# EAGLE schematic Svari (EAGLE 9.5.2)
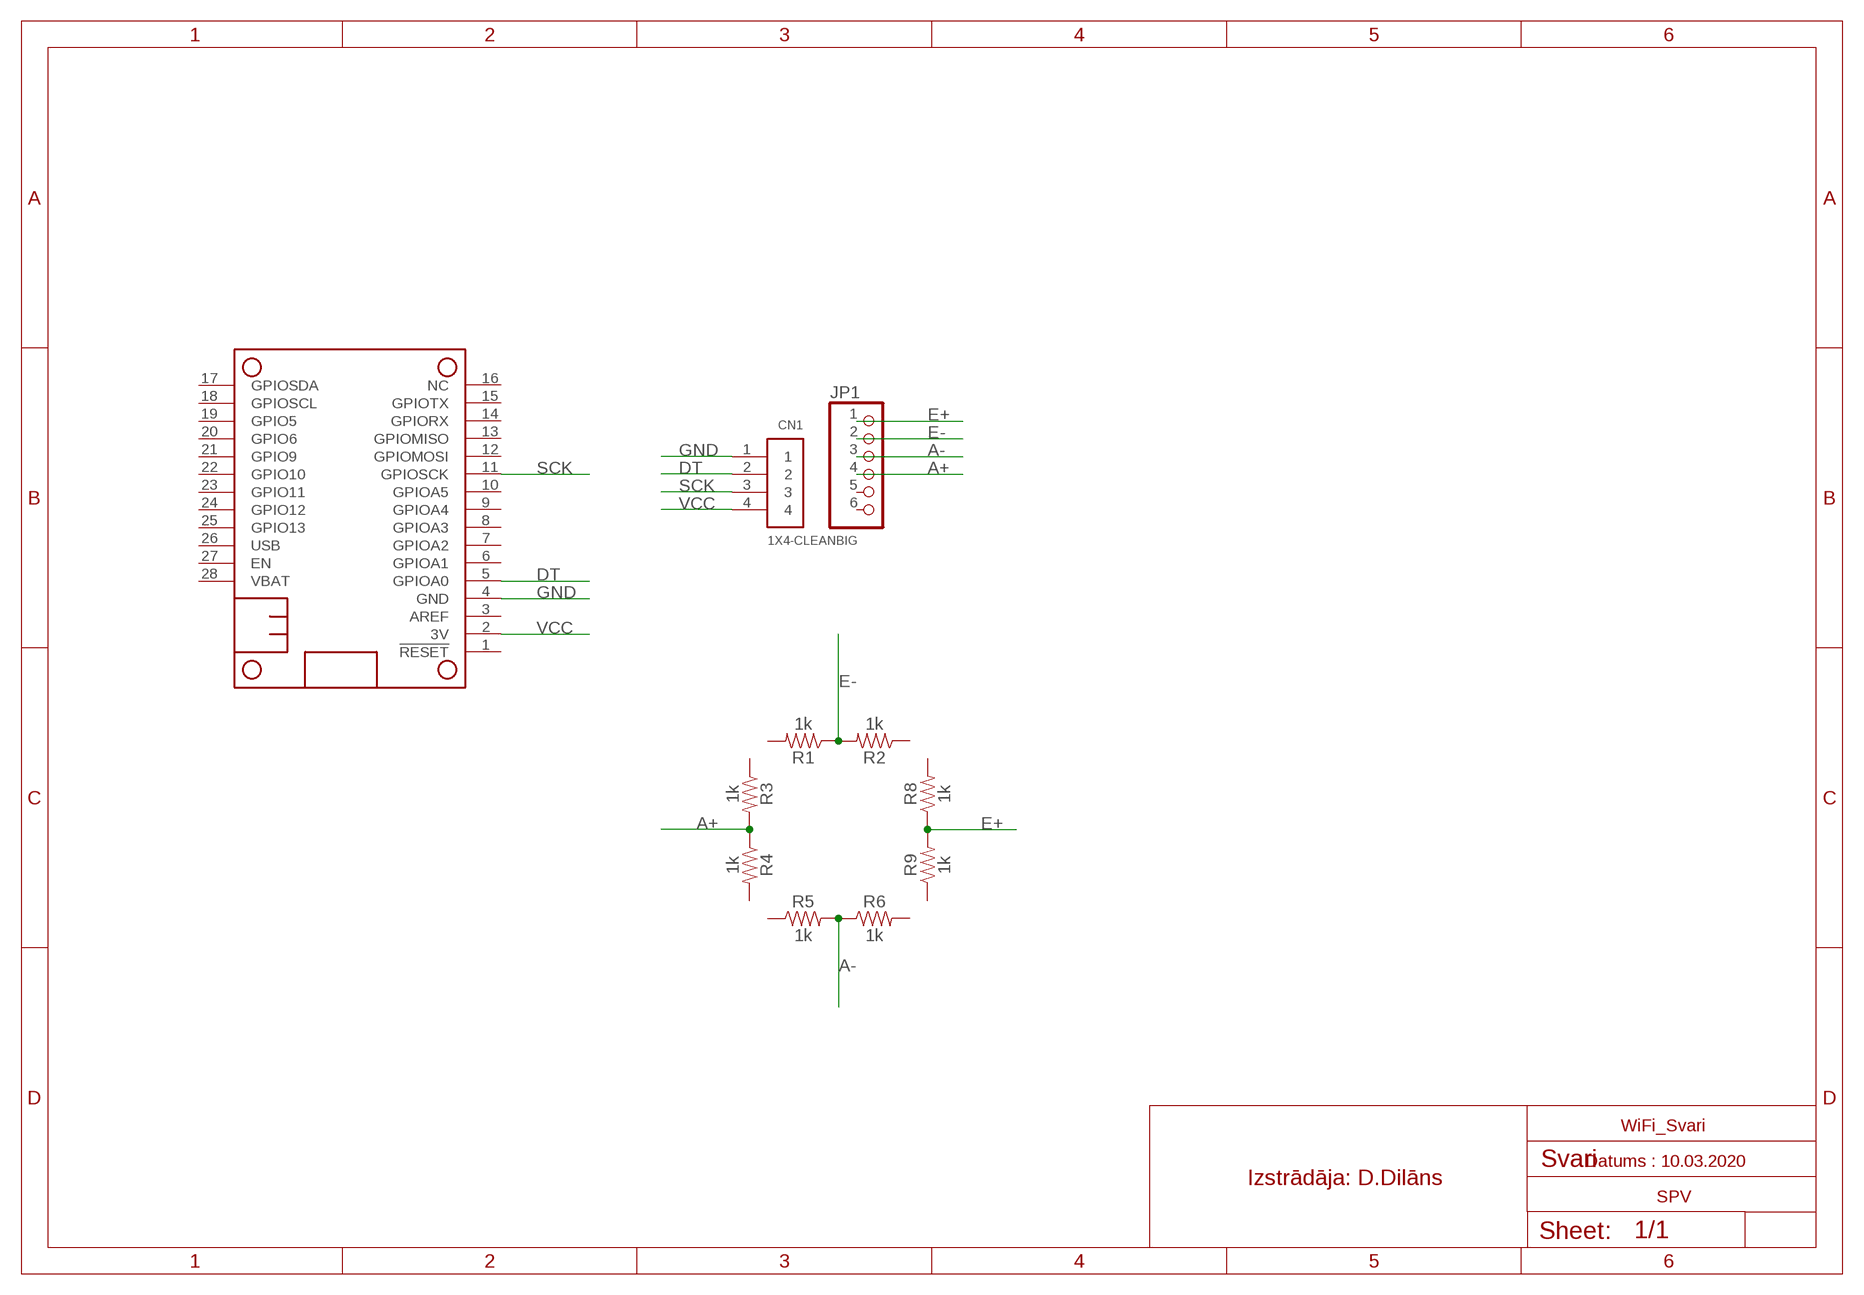
[diagram p0: schematic, sheet 1]

## Parts
CN1  1X4-CLEANBIG  [1X04-CLEANBIG]
JP1  PINHD-1X6  [1X06]
MS1  FEATHERWING  [FEATHERWING]
R1  1k  1.5KOHM-0603-1/10W-1%  [0603]
R2  1k  1.5KOHM-0603-1/10W-1%  [0603]
R3  1k  1.5KOHM-0603-1/10W-1%  [0603]
R4  1k  1.5KOHM-0603-1/10W-1%  [0603]
R5  1k  1.5KOHM-0603-1/10W-1%  [0603]
R6  1k  1.5KOHM-0603-1/10W-1%  [0603]
R8  1k  1.5KOHM-0603-1/10W-1%  [0603]
R9  1k  1.5KOHM-0603-1/10W-1%  [0603]

## Nets
A+: JP1.4 R3.2 R4.1
A-: JP1.3 R5.2 R6.1
DT: CN1.2 MS1.5(GPIOA0)
E+: JP1.1 R8.1 R9.2
E-: JP1.2 R1.1 R2.2 R8.2
GND: CN1.1 MS1.4(GND)
SCK: CN1.3 MS1.11(GPIOSCK)
VCC: CN1.4 MS1.2(3V)
Unconnected: JP1.5 JP1.6 MS1.1(!RESET) MS1.3(AREF) MS1.6(GPIOA1) MS1.7(GPIOA2) MS1.8(GPIOA3) MS1.9(GPIOA4) MS1.10(GPIOA5) MS1.12(GPIOMOSI) MS1.13(GPIOMISO) MS1.14(GPIORX) MS1.15(GPIOTX) MS1.16(NC) MS1.17(GPIOSDA) MS1.18(GPIOSCL) MS1.19(GPIO5) MS1.20(GPIO6) MS1.21(GPIO9) MS1.22(GPIO10) MS1.23(GPIO11) MS1.24(GPIO12) MS1.25(GPIO13) MS1.26(USB) MS1.27(EN) MS1.28(VBAT) R1.2 R2.1 R3.1 R4.2 R5.1 R6.2 R9.1

## Notes on the sheet
- WiFi_Svari
- Datums : 10.03.2020
- Izstrādāja: D.Dilāns
- SPV

## Library data of the parts
CN1 = adafruit:1X4: 4-pin connector
JP1 = adafruit:PINHD-1X6: PIN HEADER
MS1 = adafruit:FEATHERWING
R1-R6 R8 R9 = SparkFun-Resistors:1.5KOHM: 1.5kΩ resistor A resistor is a passive two-terminal electrical component that implements electrical resistance as a circuit element. Resistors act to reduce current flow, and, at the same time, act to lower voltage levels within circuits. - Wikipedia; PROD_ID: RES-08306; VALUE: 1.5k